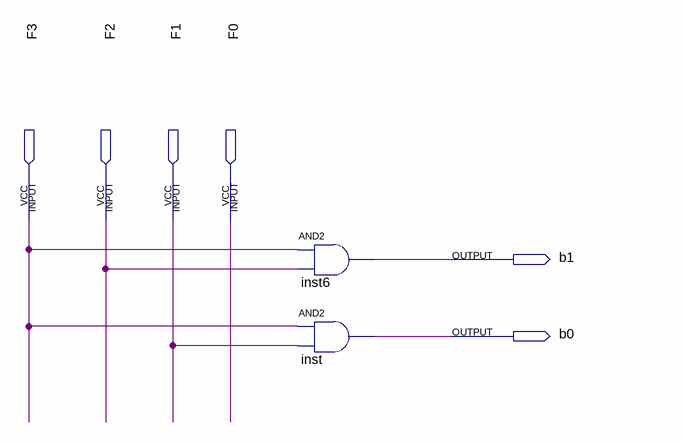
[diagram p0: schematic sheet]
// Quartus schematic encoder.bdf as structural Verilog: 2 symbols, 6 pins
module encoder (
  input  F3,
  input  F2,
  input  F1,
  input  F0,
  output b1,
  output b0
);

  and inst6 (b1, F3, F2);
  and inst (b0, F3, F1);
endmodule
